# EAGLE schematic RFID_ver_1.0 (EAGLE 9.6.2)
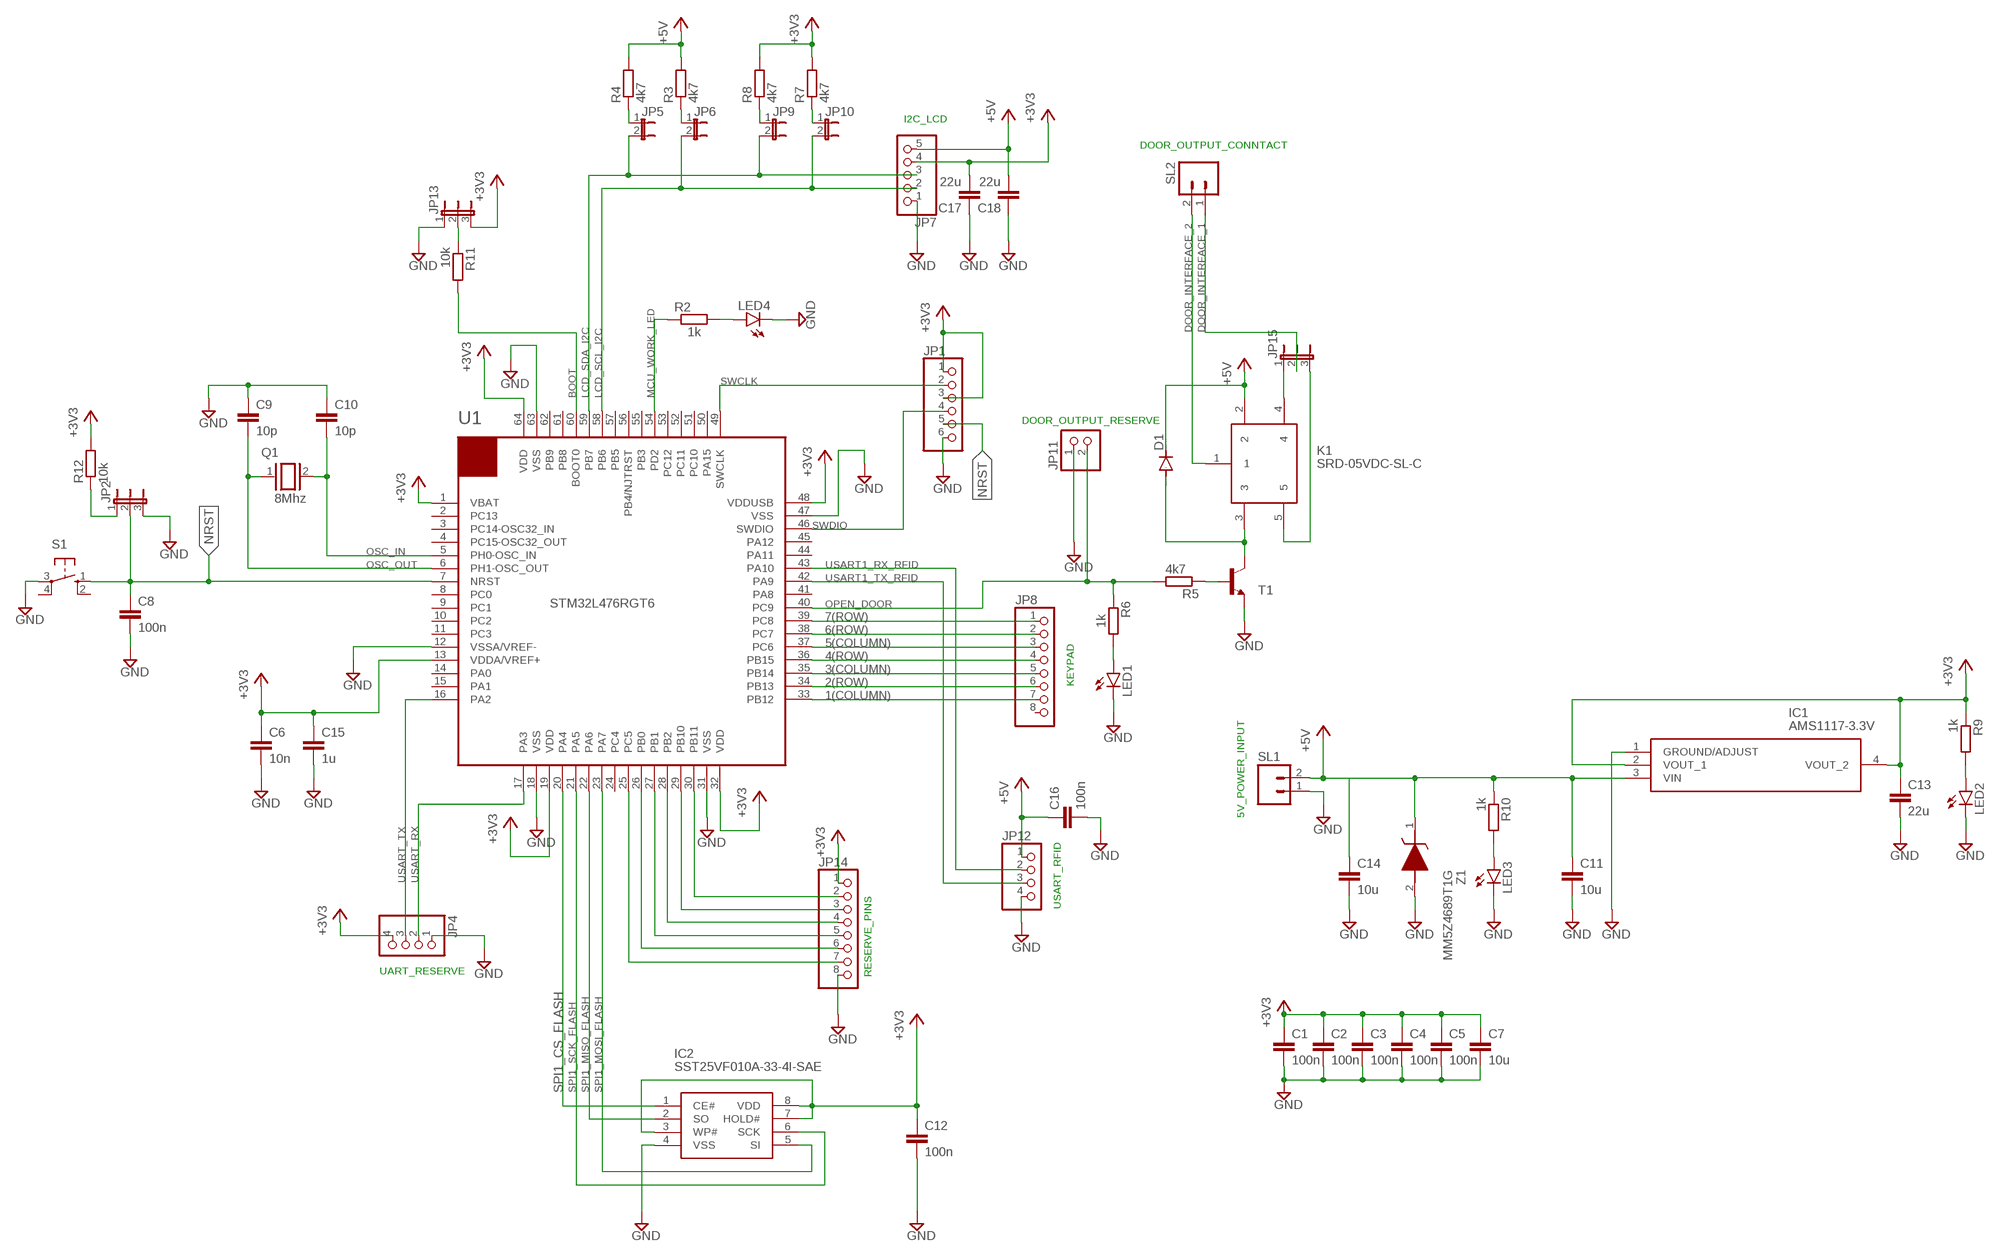
[diagram p0: schematic, sheet 1]

## Parts
C1  100n  C-EUC0805  [C0805]
C2  100n  C-EUC0805  [C0805]
C3  100n  C-EUC0805  [C0805]
C4  100n  C-EUC0805  [C0805]
C5  100n  C-EUC0805  [C0805]
C6  10n  C-EUC0805  [C0805]
C7  10u  C-EUC0805  [C0805]
C8  100n  C-EUC0805  [C0805]
C9  10p  C-EUC0805  [C0805]
C10  10p  C-EUC0805  [C0805]
C11  10u  C-EUC0805  [C0805]
C12  100n  C-EUC0805  [C0805]
C13  22u  C-EUC0805  [C0805]
C14  10u  C-EUC0805  [C0805]
C15  1u  C-EUC0805  [C0805]
C16  100n  C-EUC0805  [C0805]
C17  22u  C-EUC0805  [C0805]
C18  22u  C-EUC0805  [C0805]
D1  DIODE-DO-214AC  [DO-214AC]
IC1  AMS1117-3.3V  [SOT229P700X180-4N]
IC2  SST25VF010A-33-4I-SAE  [SOIC127P600X175-8N]
JP1  PINHD-1X6  [1X06]
JP2  JP2E  [JP2]
JP4  PINHD-1X4  [1X04]
JP5  JP1E  [JP1]
JP6  JP1E  [JP1]
JP7  PINHD-1X5  [1X05]
JP8  PINHD-1X8  [1X08]
JP9  JP1E  [JP1]
JP10  JP1E  [JP1]
JP11  PINHD-1X2  [1X02]
JP12  PINHD-1X4  [1X04]
JP13  JP2E  [JP2]
JP14  PINHD-1X8  [1X08]
JP15  JP2E  [JP2]
K1  SRD-05VDC-SL-C  [SRD]
LED1  LEDCHIP-LED0805  [CHIP-LED0805]
LED2  LEDCHIP-LED0805  [CHIP-LED0805]
LED3  LEDCHIP-LED0805  [CHIP-LED0805]
LED4  LEDCHIP-LED0805  [CHIP-LED0805]
Q1  8Mhz  XTAL/S  [QS]
R2  1k  R-EU_R0805  [R0805]
R3  4k7  R-EU_R0805  [R0805]
R4  4k7  R-EU_R0805  [R0805]
R5  4k7  R-EU_R0805  [R0805]
R6  1k  R-EU_R0805  [R0805]
R7  4k7  R-EU_R0805  [R0805]
R8  4k7  R-EU_R0805  [R0805]
R9  1k  R-EU_R0805  [R0805]
R10  1k  R-EU_R0805  [R0805]
R11  10k  R-EU_R0805  [R0805]
R12  10k  R-EU_R0805  [R0805]
S1  10-XX  [B3F-10XX]
SL1  M02  [02P]
SL2  M02  [02P]
T1  BC817-NPN-SOT23-BEC  [SOT23-BEC]
U1  STM32L476RGT6  [LQFP-64]
Z1  MM5Z4689T1G  [SODFL1608X70N]

## Nets
1(COLUMN): JP8.7 U1.33(PB12)
2(ROW): JP8.6 U1.34(PB13)
3(COLUMN): JP8.5 U1.35(PB14)
4(ROW): JP8.4 U1.36(PB15)
5(COLUMN): JP8.3 U1.37(PC6)
6(ROW): JP8.2 U1.38(PC7)
7(ROW): JP8.1 U1.39(PC8)
+3V3: C1.1 C2.1 C3.1 C4.1 C5.1 C6.1 C7.1 C12.1 C13.1 C15.1 C17.2 IC1.2(VOUT_1) IC1.4(VOUT_2) IC2.3(WP#) IC2.7(HOLD#) IC2.8(VDD) JP1.1 JP1.3 JP4.4 JP7.4 JP13.3 JP14.1 R7.2 R8.2 R9.1 R12.2 U1.1(VBAT) U1.13(VDDA/VREF+) U1.19(VDD) U1.32(VDD) U1.48(VDDUSB) U1.64(VDD)
+5V: C11.1 C16.1 C18.2 D1.C IC1.3(VIN) JP7.5 JP12.1 K1.2 R3.2 R4.2 R10.1 SL1.2 Z1.1(K)
+5V1: C14.1
BOOT: R11.2 U1.60(BOOT0)
DOOR_INTERFACE_1: JP15.2 SL2.1
GND: C1.2 C2.2 C3.2 C4.2 C5.2 C6.2 C7.2 C8.2 C9.1 C10.1 C11.2 C12.2 C13.2 C14.2 C15.2 C16.2 C17.1 C18.1 IC1.1(GROUND/ADJUST) IC2.4(VSS) JP1.6 JP2.3 JP4.1 JP7.1 JP11.1 JP12.4 JP13.1 JP14.8 LED1.C LED2.C LED3.C LED4.C S1.3(P) SL1.1 T1.E U1.12(VSSA/VREF-) U1.18(VSS) U1.31(VSS) U1.47(VSS) U1.63(VSS) Z1.2(A)
LCD_SCL_I2C: JP6.2 JP7.2 JP10.2 U1.58(PB6)
LCD_SDA_I2C: JP5.2 JP7.3 JP9.2 U1.59(PB7)
MCU_WORK_LED: R2.1 U1.54(PD2)
N$1: LED4.A R2.2
N$2: JP14.2 U1.30(PB11)
N$3: C10.2 Q1.2 U1.5(PH0-OSC_IN)
N$4: JP10.1 R7.1
N$5: JP6.1 R3.1
N$6: JP5.1 R4.1
N$7: R5.1 T1.B
N$8: LED1.A R6.2
N$10: D1.A K1.3 T1.C
N$11: K1.1 SL2.2
N$12: JP15.1 K1.4
N$13: JP9.1 R8.1
N$14: LED2.A R9.2
N$15: JP12.3 U1.42(PA9)
N$16: JP15.3 K1.5
N$17: LED3.A R10.2
N$18: JP2.1 R12.1
N$19: JP13.2 R11.1
N$20: JP14.3 U1.29(PB10)
N$21: JP14.4 U1.28(PB2)
N$22: JP14.5 U1.27(PB1)
N$23: JP14.6 U1.26(PB0)
N$24: JP14.7 U1.25(PC5)
NRST: C8.1 JP1.5 JP2.2 S1.1(S) U1.7(NRST)
OPEN_DOOR: JP11.2 R5.2 R6.1 U1.40(PC9)
OSC_OUT: C9.2 Q1.1 U1.6(PH1-OSC_OUT)
SPI1_CS_FLASH: IC2.1(CE#) U1.20(PA4)
SPI1_MISO_FLASH: IC2.2(SO) U1.22(PA6)
SPI1_MOSI_FLASH: IC2.5(SI) U1.23(PA7)
SPI1_SCK_FLASH: IC2.6(SCK) U1.21(PA5)
SWCLK: JP1.2 U1.49(SWCLK)
SWDIO: JP1.4 U1.46(SWDIO)
USART1_RX_RFID: JP12.2 U1.43(PA10)
USART_RX: JP4.2 U1.17(PA3)
USART_TX: JP4.3 U1.16(PA2)
Unconnected: JP8.8 S1.2(S1) S1.4(P1) U1.2(PC13) U1.3(PC14-OSC32_IN) U1.4(PC15-OSC32_OUT) U1.8(PC0) U1.9(PC1) U1.10(PC2) U1.11(PC3) U1.14(PA0) U1.15(PA1) U1.24(PC4) U1.41(PA8) U1.44(PA11) U1.45(PA12) U1.50(PA15) U1.51(PC10) U1.52(PC11) U1.53(PC12) U1.55(PB3) U1.56(PB4/NJTRST) U1.57(PB5) U1.61(PB8) U1.62(PB9)

## Notes on the sheet
- I2C_LCD
- DOOR_OUTPUT_CONNTACT
- DOOR_OUTPUT_RESERVE
- KEYPAD
- 5V_POWER_INPUT
- RESERVE_PINS
- USART_RFID
- UART_RESERVE

## Library data of the parts
C1-C18 = rcl:C-EU: CAPACITOR, European symbol; SPICEPREFIX: C
D1 = diode:DIODE-: DIODE
IC1 = ams1117-3.3v:AMS1117-3.3V: 1A LOW DROPOUT VOLTAGE REGULATOR, SOT-223 Source: Datasheet <http://www.advanced-monolithic.com/pdf/ds1117.pdf>; DESCRIPTION: 1A LOW DROPOUT VOLTAGE REGULATOR, SOT-223; HEIGHT: 1.8mm; MANUFACTURER_NAME: Advanced Monolithic Systems; MANUFACTURER_PART_NUMBER: ams1117-3.3v
IC2 = SST25VF010A-33-4I-SAE:SST25VF010A-33-4I-SAE: 2.7V to 3.6V 1Mbit SPI Serial Flash Source: Datasheet <http://ww1.microchip.com/downloads/en/DeviceDoc/25081A.pdf>; DESCRIPTION: 2.7V to 3.6V 1Mbit SPI Serial Flash; HEIGHT: 1.75mm; MANUFACTURER_NAME: Microchip; MANUFACTURER_PART_NUMBER: SST25VF010A-33-4I-SAE; MOUSER_PART_NUMBER: 804-25VF010A3ISAE; MOUSER_PRICE-STOCK: https://www.mouser.co.uk/ProductDetail/Microchip-Technology-Atmel/SST25VF010A-33-4I-SAE?qs=sPPKN8MmjEr1PNmAqOrxYQ%3D%3D
JP1 = pinhead:PINHD-1X6: PIN HEADER
JP2 JP13 JP15 = jumper:JP2E: JUMPER
JP4 JP12 = pinhead:PINHD-1X4: PIN HEADER
JP5 JP6 JP9 JP10 = jumper:JP1E: JUMPER
JP7 = pinhead:PINHD-1X5: PIN HEADER
JP8 JP14 = pinhead:PINHD-1X8: PIN HEADER
JP11 = pinhead:PINHD-1X2: PIN HEADER
K1 = SRD-05VDC-SL-C:SRD-05VDC-SL-C: Relay Source: Datasheet <http://files.microjpm.webnode.com/200001010-dda41de9e1/Songle Relay Datasheet.pdf>; DESCRIPTION: Relay; HEIGHT: mm; MANUFACTURER_NAME: Songle Relay; MANUFACTURER_PART_NUMBER: SRD-05VDC-SL-C
LED1-LED4 = led:LED: LED OSRAM: - CHIPLED LG R971, LG N971, LY N971, LG Q971, LY Q971, LO R971, LY R971 LH N974, LH R974 LS Q976, LO Q976, LY Q976 LO Q996 - Hyper CHIPLED LW Q18S LB Q993, LB Q99A, LB R99A - SideLED LS A670, LO A670, LY A670, LG A670, LP A670 LB A673, LV A673, LT A673, LW A673 LH A674 LY A675 LS A676, LA A676, LO A676, LY A676, LW A676 LS A679, LY A679, LG A679 - Hyper Micro SIDELED® LS Y876, LA Y876, LO Y876, LY Y876 LT Y87S - SmartLED LW L88C, LW L88S LB L89C, LB L89S, LG L890 LS L89K, LO L89K, LY L89K LS L896, LA L896, LO L896, LY L896 - TOPLED LS T670, LO T670, LY T670, LG T670, LP T670 LSG T670, LSP T670, LSY T670, LOP T670, LYG T670 LG T671, LOG T671, LSG T671 LB T673, LV T673, LT T673, LW T673 LH T674 LS T676, LA T676, LO T676, LY T676, LB T676, LH T676, LSB T676, LW T676 LB T67C, LV T67C, LT T67C, LS T67K, LO T67K, LY T67K, LW E67C LS E67B, LA E67B, LO E67B, LY E67B, LB E67C, LV E67C, LT E67C LW T67C LS T679, LY T679, LG T679 LS T770, LO T770, LY T770, LG T770, LP T770 LB T773, LV T773, LT T773, LW T773 LH T774 LS E675, LA E675, LY E675, LS T675 LS T776, LA T776, LO T776, LY T776, LB T776 LHGB T686 LT T68C, LB T68C - Hyper Mini TOPLED® LB M676 - Mini TOPLED Santana® LG M470 LS M47K, LO M47K, LY M47K Source: http://www.osram.convergy.de LUXEON: - LUMILED® LXK2-PW12-R00, LXK2-PW12-S00, LXK2-PW14-U00, LXK2-PW14-V00 LXK2-PM12-R00, LXK2-PM12-S00, LXK2-PM14-U00 LXK2-PE12-Q00, LXK2-PE12-R00, LXK2-PE12-S00, LXK2-PE14-T00, LXK2-PE14-U00 LXK2-PB12-K00, LXK2-PB12-L00, LXK2-PB12-M00, LXK2-PB14-N00, LXK2-PB14-P00, LXK2-PB14-Q00 LXK2-PR12-L00, LXK2-PR12-M00, LXK2-PR14-Q00, LXK2-PR14-R00 LXK2-PD12-Q00, LXK2-PD12-R00, LXK2-PD12-S00 LXK2-PH12-R00, LXK2-PH12-S00 LXK2-PL12-P00, LXK2-PL12-Q00, LXK2-PL12-R00 Source: www.luxeon.com KINGBRIGHT: KA-3528ASYC Source: www.kingbright.com
Q1 = special:XTAL/S: CRYSTAL
R2-R12 = rcl:R-EU_: RESISTOR, European symbol; SPICEPREFIX: R
S1 = switch-omron:10-XX: OMRON SWITCH; MPN: B3F-1000; OC_FARNELL: 176432; OC_NEWARK: 36M3542
SL1 SL2 = con-amp-quick:M02: AMP QUICK CONNECTOR; OC_FARNELL: unknown; OC_NEWARK: unknown
T1 = transistor-neu-to92:*-NPN-: NPN Transistror
U1 = STM32:STM32L476R: STM32L476RXX - Ultra-low-power ARM ® Cortex ® -M4 32-bit MCU+FPU, 100DMIPS, up to 1MB Flash, 128 KB SRAM, USB OTG FS, LCD, analog, audio Datasheet <http://www.st.com/st-web-ui/static/active/en/resource/technical/document/datasheet/DM00108832.pdf>; FLASH: 1MB; MFPN: STM32L476RGT6
Z1 = MM5Z4689T1G:MM5Z4689T1G: ONSEMI - MM5Z4689T1G - Zener Single Diode, 5.1 V, 500 mW, SOD-523, 2 Pins, 150 C Source: Datasheet <https://www.mouser.in/datasheet/2/308/1/MM5Z4678T1_D-2315920.pdf>; DESCRIPTION: ONSEMI - MM5Z4689T1G - Zener Single Diode, 5.1 V, 500 mW, SOD-523, 2 Pins, 150 C; HEIGHT: 0.7mm; MANUFACTURER_NAME: onsemi; MANUFACTURER_PART_NUMBER: MM5Z4689T1G; MOUSER_PART_NUMBER: 863-MM5Z4689T1G; MOUSER_PRICE-STOCK: https://www.mouser.co.uk/ProductDetail/onsemi/MM5Z4689T1G?qs=xZ%2FP%252Ba9zWqbSR0qW%2F37mQQ%3D%3D